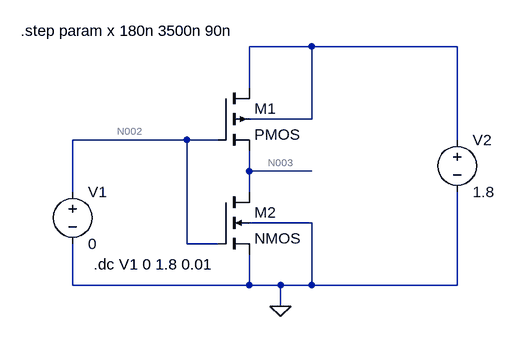
[diagram p0: schematic Draft1.asc]
Draft1.asc, the LTspice schematic file:
Version 4
SHEET 1 880 680
WIRE 256 0 160 0
WIRE 480 0 256 0
WIRE 160 64 160 0
WIRE 256 112 256 0
WIRE 256 112 160 112
WIRE 64 144 -112 144
WIRE 112 144 64 144
WIRE 480 144 480 0
WIRE 160 192 160 160
WIRE 256 192 160 192
WIRE -112 224 -112 144
WIRE 160 224 160 192
WIRE 256 272 160 272
WIRE 64 304 64 144
WIRE 112 304 64 304
WIRE -112 368 -112 304
WIRE 160 368 160 320
WIRE 160 368 -112 368
WIRE 208 368 160 368
WIRE 256 368 256 272
WIRE 256 368 208 368
WIRE 480 368 480 224
WIRE 480 368 256 368
WIRE 208 400 208 368
FLAG 208 400 0
SYMBOL pmos4 112 64 R0
SYMATTR InstName M1
SYMATTR Value2 l=180n w={x}
SYMBOL nmos4 112 224 R0
SYMATTR InstName M2
SYMATTR Value2 l=180n w=900n
SYMBOL voltage -112 208 R0
WINDOW 123 0 0 Left 0
WINDOW 39 0 0 Left 0
SYMATTR InstName V1
SYMATTR Value 0
SYMBOL voltage 480 128 R0
WINDOW 123 0 0 Left 0
WINDOW 39 0 0 Left 0
SYMATTR InstName V2
SYMATTR Value 1.8
TEXT -80 336 Left 2 !.dc V1 0 1.8 0.01
TEXT -192 -24 Left 2 !.step param x 180n 3500n 90n

The netlist it stands for:
* Draft1.asc
M1 N001 N002 N003 N001 PMOS l=180n w={x}
M2 N003 N002 0 0 NMOS l=180n w=900n
V1 N002 0 0
V2 N001 0 1.8
.model NMOS NMOS
.model PMOS PMOS
.lib standard.mos
.dc V1 0 1.8 0.01
.step param x 180n 3500n 90n
.backanno
.end

* Results of the author's LTspice run, read from the files saved beside the schematic
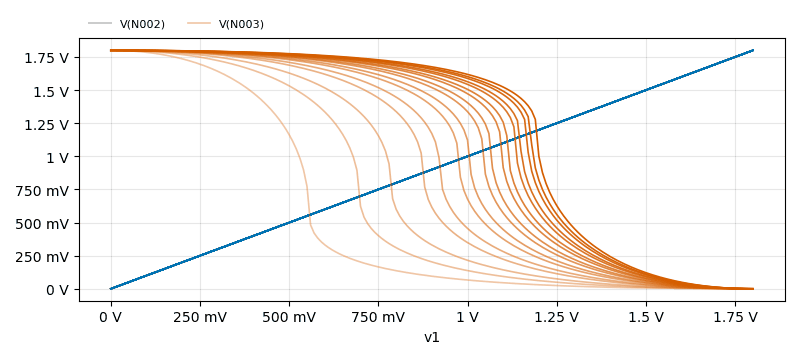
[diagram p1: DC transfer characteristic of Draft1.asc, plotted from the saved traces]
* DC transfer characteristic, 38 runs:
*   V(N002) [run 1]: 0 V at v1=0 V, 1.8 V at v1=1.8 V, min 0 V, max 1.8 V
*   V(N002) [run 2]: 0 V at v1=0 V, 1.8 V at v1=1.8 V, min 0 V, max 1.8 V
*   V(N002) [run 3]: 0 V at v1=0 V, 1.8 V at v1=1.8 V, min 0 V, max 1.8 V
*   V(N002) [run 4]: 0 V at v1=0 V, 1.8 V at v1=1.8 V, min 0 V, max 1.8 V
*   V(N002) [run 5]: 0 V at v1=0 V, 1.8 V at v1=1.8 V, min 0 V, max 1.8 V
*   V(N002) [run 6]: 0 V at v1=0 V, 1.8 V at v1=1.8 V, min 0 V, max 1.8 V
*   V(N002) [run 7]: 0 V at v1=0 V, 1.8 V at v1=1.8 V, min 0 V, max 1.8 V
*   V(N002) [run 8]: 0 V at v1=0 V, 1.8 V at v1=1.8 V, min 0 V, max 1.8 V
*   V(N003) [run 1]: 1.8 V at v1=0 V, 20.02 nV at v1=1.8 V, min 20.02 nV, max 1.8 V
*   V(N003) [run 2]: 1.8 V at v1=0 V, 19.91 nV at v1=1.8 V, min 19.91 nV, max 1.8 V
*   V(N003) [run 3]: 1.8 V at v1=0 V, 19.74 nV at v1=1.8 V, min 19.74 nV, max 1.8 V
*   V(N003) [run 4]: 1.8 V at v1=0 V, 19.34 nV at v1=1.8 V, min 19.34 nV, max 1.8 V
*   V(N003) [run 5]: 1.8 V at v1=0 V, 18.98 nV at v1=1.8 V, min 18.98 nV, max 1.8 V
*   V(N003) [run 6]: 1.8 V at v1=0 V, 18.32 nV at v1=1.8 V, min 18.32 nV, max 1.8 V
*   V(N003) [run 7]: 1.8 V at v1=0 V, 17.79 nV at v1=1.8 V, min 17.79 nV, max 1.8 V
*   V(N003) [run 8]: 1.8 V at v1=0 V, 16.85 nV at v1=1.8 V, min 16.85 nV, max 1.8 V